# EAGLE design cp2102n-uart-usb (EAGLE 9.6.2)
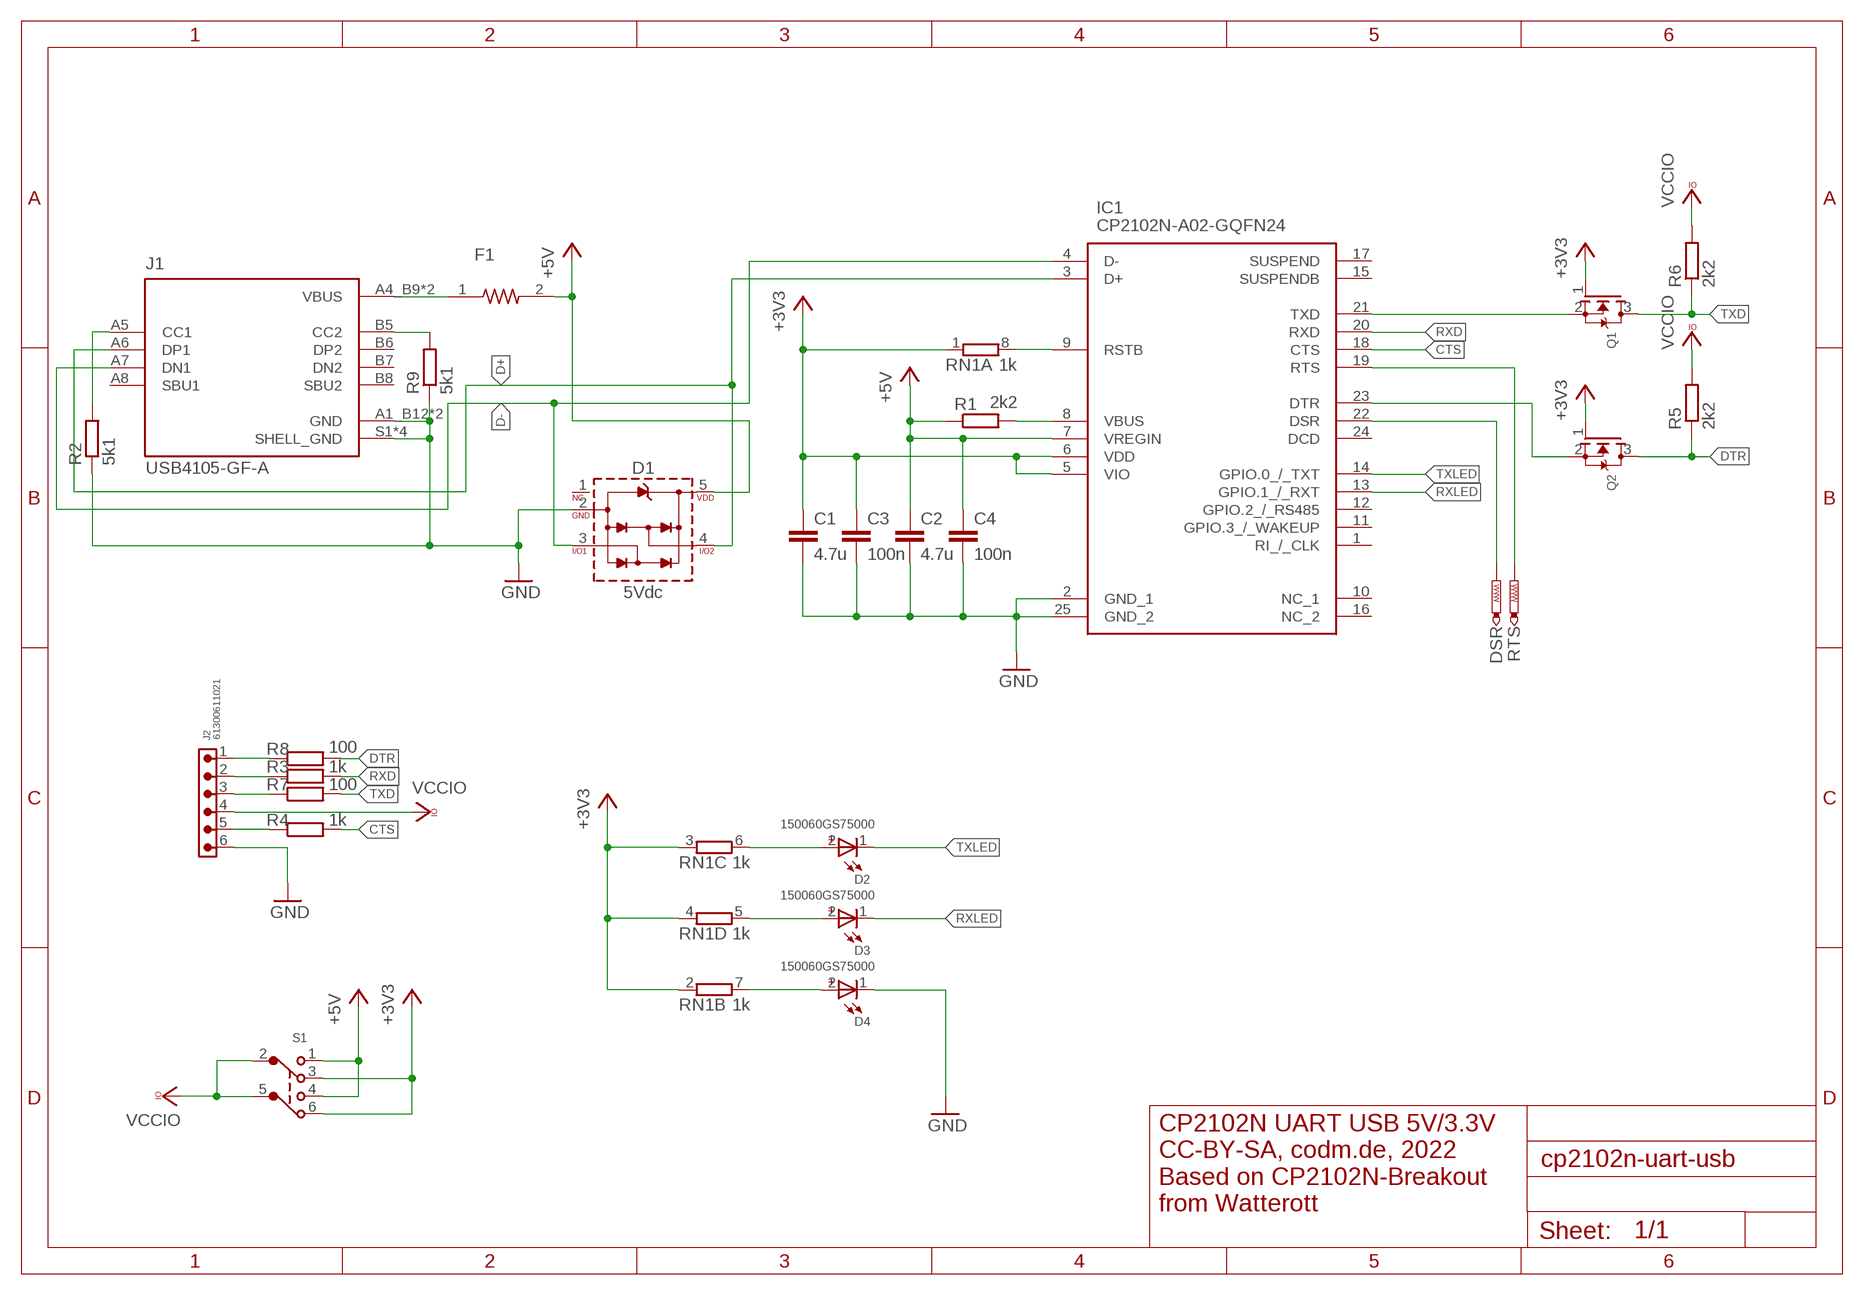
[diagram p0: schematic, sheet 1]

## Parts
C1  4.7u  C-EUC0603K  [C0603K]
C2  4.7u  C-EUC0603K  [C0603K]
C3  100n  C-EUC0603K  [C0603K]
C4  100n  C-EUC0603K  [C0603K]
D1  5Vdc  WE-TVS-HS_SOT23-5L_824011  [WE-TVS_SOT23-5L]
D2  150060GS75000  WL-SMCW_0603_150060GS75000  [WL-SMCW_0603]
D3  150060GS75000  WL-SMCW_0603_150060GS75000  [WL-SMCW_0603]
D4  150060GS75000  WL-SMCW_0603_150060GS75000  [WL-SMCW_0603]
DSR  PTR1B2,54  [B2,54]
F1  PICOSMDC050S-2  [RESC2012X65N]
IC1  CP2102N-A02-GQFN24  [QFN50P400X400X80-25N]
J1  USB4105-GF-A  [GCT_USB4105-GF-A]
J2  61300611021  6130XX11021_61300611021  [61300611021]
Q1  MOSFET-NREFLOW  [SOT23]
Q2  MOSFET-NREFLOW  [SOT23]
R1  2k2  R-EU_R0603RF  [R0603RF]
R2  5k1  R-EU_R0603RF  [R0603RF]
R3  1k  R-EU_R0603RF  [R0603RF]
R4  1k  R-EU_R0603RF  [R0603RF]
R5  2k2  R-EU_R0603RF  [R0603RF]
R6  2k2  R-EU_R0603RF  [R0603RF]
R7  100  R-EU_R0603RF  [R0603RF]
R8  100  R-EU_R0603RF  [R0603RF]
R9  5k1  R-EU_R0603RF  [R0603RF]
RN1  1k  4R-NEXB38V  [EXB38V]
RTS  PTR1B2,54  [B2,54]
S1  452403012014  [452403012014]

## Nets
+3V3: C1.1 C3.1 IC1.5(VIO) IC1.6(VDD) Q1.1(G) Q2.1(G) RN1.1 RN1.2 RN1.3 RN1.4 S1.3 S1.6
+5V: C2.1 C4.1 D1.5(VDD) F1.2 IC1.7(VREGIN) R1.1 S1.1 S1.4
CTS: IC1.18(CTS) R4.2
D+: D1.4(I/O2) IC1.3(D+) J1.A6(DP1)
D-: D1.3(I/O1) IC1.4(D-) J1.A7(DN1)
DTR: Q2.3(D) R5.1 R8.2
GND: C1.2 C2.2 C3.2 C4.2 D1.2(GND) D4.1(-) IC1.2(GND_1) IC1.25(GND_2) J1.A1_B12(GND) J1.B1_A12(GND) J1.S1(SHELL_GND) J1.S2(SHELL_GND) J1.S3(SHELL_GND) J1.S4(SHELL_GND) J2.6 R2.1 R9.1
N$1: J1.A5(CC1) R2.2
N$2: D3.2(+) RN1.5
N$3: IC1.19(RTS) RTS.TP
N$4: D2.2(+) RN1.6
N$5: J1.B5(CC2) R9.2
N$6: DSR.TP IC1.22(DSR)
N$7: F1.1 J1.A4_B9(VBUS) J1.B4_A9(VBUS)
N$8: IC1.21(TXD) Q1.2(S)
N$9: IC1.23(DTR) Q2.2(S)
N$10: J2.1 R8.1
N$11: J2.2 R3.1
N$12: J2.3 R7.1
N$13: J2.5 R4.1
N$15: D4.2(+) RN1.7
RSTB: IC1.9(RSTB) RN1.8
RXD: IC1.20(RXD) R3.2
RXLED: D3.1(-) IC1.13(GPIO.1_/_RXT)
TXD: Q1.3(D) R6.1 R7.2
TXLED: D2.1(-) IC1.14(GPIO.0_/_TXT)
VBUS: IC1.8(VBUS) R1.2
VCCIO: J2.4 R5.2 R6.2 S1.2 S1.5
Unconnected: D1.1(NC) IC1.1(RI_/_CLK) IC1.10(NC_1) IC1.11(GPIO.3_/_WAKEUP) IC1.12(GPIO.2_/_RS485) IC1.15(SUSPENDB) IC1.16(NC_2) IC1.17(SUSPEND) IC1.24(DCD) J1.A8(SBU1) J1.B6(DP2) J1.B7(DN2) J1.B8(SBU2)

## Notes on the sheet
- CP2102N UART USB 5V/3.3V
  CC-BY-SA, codm.de, 2022
  Based on CP2102N-Breakout
  from Watterott

## Library data of the parts
C1-C4 = rcl:C-EU: CAPACITOR, European symbol; SPICEPREFIX: C
D1 = Eagle_WE-TVS (rev22a):WE-TVS-HS_SOT23-5L_824011: WE-TVS TVS Diode – High Speed Series Characteristics Low clamping voltage Sturdy design Very low capacitance Flow Thru Design for a simple layout Rail to Rail protection Epoxy flame resistant UL94-V0 RoHS, REACH and free of halogens Applications Very fast data lines USB 2.0 Ethernet PoE VGA Sim Cards Keypads HS = High Speed <https://www.we-online.com/catalog/media/o14883v209%20Family_WE-TVS_HIGHSPEED.jpg> Details see: https://www.we-online.com/catalog/en/WE-TVS-HS Updated by Ella Wu 2021-12-16 2021(C) Wurth Elektronik; C-CH: 2pF; CHANNELS: 2+1; DATASHEET-URL: https://www.we-online.com/catalog/datasheet/824011.pdf; IPEAK: 13A; MOUNT: SMT; PART-NUMBER: 824011; VBR: 6.1V
D2-D4 = Eagle_WL-SMCW (rev22a):WL-SMCW_0603: WL-SMCW SMT Mono-color Chip LED Waterclea Characteristics Low energy consumption High reliability Low current requirement Fast switching No UV/IR radiation Smallest SMD LED package for exceptional brightness Top view LED Wide viewing angle Better solder ability Heat dissipation Applications Backlight for mobile and portable device keypads Indoor and outdoor message boards Flat backlight for LCDs, switches and symbols Display for industrial control systems and traffic Miniaturized color effects Pedestrian mark Optical indicators Tabular backlight: LCD, telephone key-press, power-switch, display board Indoor displays Signals Identifiers Backlight for automobile DVD LED General lighting Toys <https://www.we-online.com/catalog/media/o14904v209%20Family_WL-SMCW.jpg> Details see: https://www.we-online.com/catalog/en/WL-SMCW/ Updated BY Yingchun,Shan 2020-03-18 2020(C) Wurth Elektronik; CHIP-TECHNOLOGY: InGaN; DATASHEET-URL: https://www.we-online.com/catalog/datasheet/150060GS75000.pdf; DOMINANT-WAVELENGTH: 525nm; EMITTING-COLOR: Green; FORWARD-VOLTAGE: 140°; LUMINOUS-INTENSITY: 430mcd; PART-NUMBER: 150060GS75000; PEAK-WAVELENGTH: 515nm
DSR RTS = testpad:PTR1: TEST PIN
F1 = PICOSMDC050S-2:PICOSMDC050S-2: FUSE, RESETTABLE PTC, 6VDC, 0.5A, SMD Check availability <https://pricing.snapeda.com/parts/PICOSMDC050S-2/Littelfuse%20Inc./view-part?ref=eda>; AVAILABILITY: In Stock; DESCRIPTION: Polymeric PTC Resettable Fuse 6V 500 mA Ih Surface Mount 0805 (2012 Metric), Concave; MF: Littelfuse Inc.; MP: PICOSMDC050S-2; PACKAGE: 0805 TE Connectivity; PRICE: None; PURCHASE-URL: https://pricing.snapeda.com/search/part/PICOSMDC050S-2/?ref=eda
IC1 = CP2102N-A02-GQFN24:CP2102N-A02-GQFN24: USB Interface IC USB to UART bridge - QFN24 Source: Datasheet <https://componentsearchengine.com/Datasheets/1/CP2102N-A02-GQFN24.pdf> Check availability <https://pricing.snapeda.com/parts/CP2102N-A02-GQFN24/Silicon%20Labs/view-part?ref=eda>; AVAILABILITY: In Stock; DESCRIPTION: USB Bridge, USB to UART USB 2.0 UART Interface 24-QFN (4x4); MF: Silicon Labs; MP: CP2102N-A02-GQFN24; PACKAGE: WFQFN-24 Silicon Labs; PRICE: None; PURCHASE-URL: https://pricing.snapeda.com/search/part/CP2102N-A02-GQFN24/?ref=eda
J1 = USB4105-GF-A:USB4105-GF-A: USB-C (USB TYPE-C) USB 2.0 Receptacle Connector 24 (16+8 Dummy) Position Surface Mount, Right Angle; Through Hole Check availability <https://pricing.snapeda.com/parts/USB4105-GF-A/GCT/view-part?ref=eda>; AVAILABILITY: In Stock; DESCRIPTION: USB-C (USB TYPE-C) USB 2.0 Receptacle Connector 24 (16+8 Dummy) Position Surface Mount, Right Angle; Through Hole; MF: GCT; MP: USB4105-GF-A; PACKAGE: None; PRICE: None; PURCHASE-URL: https://pricing.snapeda.com/search/part/USB4105-GF-A/?ref=eda
J2 = Eagle_WR-PHD (rev21a):6130XX11021_61300611021: WR-PHD 2.54 mm THT Angled Pin Header ARTICLE PROPERTIES: Pins:2;​ 3;​ 4;​ 5;​ 6;​ 7;​ 8;​ 9;​ 10;​ 12;​ 14;​ 16;​ 18;​ 22;​ 32;​ 34;​ 36;​ 40 KIND PROPERTIES: Pitch：2.54 mm Quality Class:3 as per CECC 75 301-802 Rows：Single Gender：Pin Header Type：Angled MATERIAL PROPERTIES: Insulator Material :PA6T Insulator Flammability Rating:UL94 V-0 Contact Material:Copper Alloy Contact Plating:Gold Contact Type:Stamped GENERAL INFORMATION Operating Temperature:-40 up to +105 °C Compliance:Lead free / RoHS ELECTRICAL PROPERTIES: Rated Current:3 A IR 1:3 A Withstanding Voltage:500 V (AC) Contact Resistance:20 mΩ RISO:1000 MΩ CERTIFICATION UL Approval:E323964 PACKAGING PROPERTIES Packaging:Bag <https://katalog.we-online.com/media/images/v2/o33210v209%20Family_WR-PHD_6130xx11021.jpg> Details see: https://katalog.we-online.com/en/em/PHD_2_54_THT_ANGLED_PIN_HEADER_6130XX11021 Updated by Yingchun,Shan 2019-10-16 2019 (C) Würth Elektronik; DATASHEET-URL: https://www.we-online.com/catalog/datasheet/61300611021.pdf; GENDER: Pin Header; IR: 3A; MOUNT: THT; PACKAGING: Bag; PART-NUMBER: 61300611021; PINS: 6; PITCH: 2.54mm; ROWS: Single; TYPE: Angled
Q1 Q2 = adafruit:MOSFET-N: N-Channel Mosfet 2N7002E - 60V 260mA SOT23 [Digikey: 2N7002ET1GOSTR-ND] - REEL BSH103 - 30V 850mA SOT23 [Digikey: 568-5013-1-ND]
R1-R9 = codm:R-EU_
RN1 = resistor-dil:4R-N: Array Chip Resistor Source: RS Component / Phycomp; OC_FARNELL: unknown; OC_NEWARK: unknown
S1 = Eagle_WS-SLSV (rev20a):452403012014: WS-SLSV SMD Mini Slide Switch, Same Side Connection 7.65 x 5.5 mm Properties Actuator Material:LCP Actuator Flammability Rating:UL94 V-0 Actuator Color:Black Frame Material:PA6T Frame Flammability Rating:UL94 V-0 Frame Color:Black Contact Material:Copper Alloy Contact Plating:Silver Terminal Material:Copper Alloy Terminal Plating:Silver VR:6 V (DC) VR:6 V (DC) Contact Resistance Initial:50 mΩ Contact Resistance After Life Test:200 mΩ RISO:100 MΩ Withstanding Voltage:500 V (AC) Qty.:1500 Electrical Properties IR:300 mA Mechanical Properties Operation Force:350g Packaging Properties Packaging :Tape and Reel <https://www.we-online.com/catalog/media/o64640v209%20Family_WS-SLSV_452403012014.jpg> Details see: https://www.we-online.com/catalog/en/SLSV_7_65X_5_5_SMD_VERTICAL/ Updated by yingchun,Shan;2020-02-25 2020(C) Würth Elektronik; DATASHEET-URL: https://www.we-online.com/catalog/datasheet/452403012014.pdf; PACKAGING: Tape and Reel; PART-NUMBER: 452403012014; QTY: 350

## Board
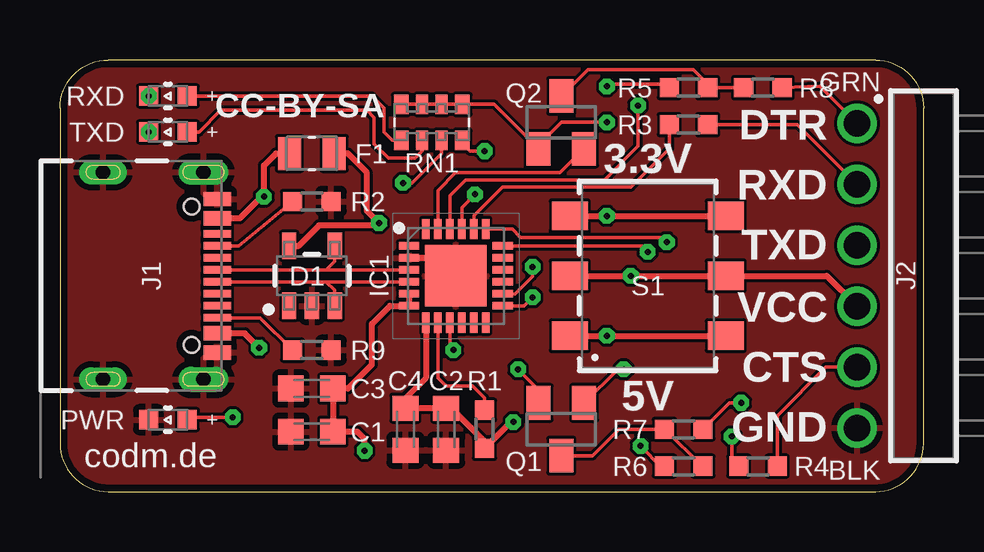
[diagram p1: board, top side]
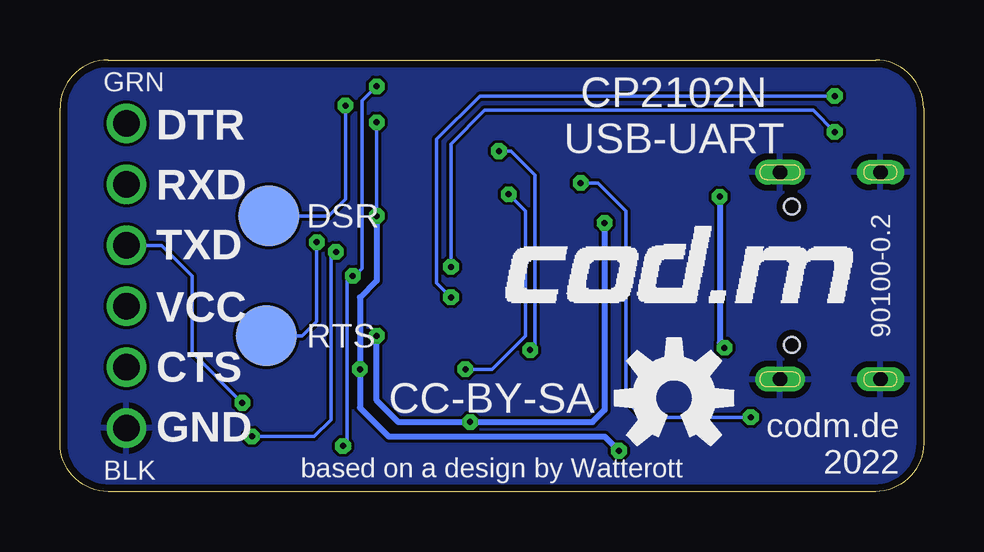
[diagram p2: board, bottom side, seen from below]

Size 36 x 18 mm. Coordinates in mm from the lower left corner, seen from the top.
Outline: 2,0 34,0 arc90 36,2 36,16 arc90 34,18 2,18 arc90 0,16 0,2 arc90 2,0
Copper layers (1*16): Top 0.035mm / dielectric 1.5mm / Bottom 0.035mm
Design rules "aisler_2_layer_complex": minimum track width 0.125mm, minimum drill 0.2mm, track to track 0.125mm, track to pad 0.125mm, pad to pad 0.125mm, via to via 0.125mm, smd to smd 0.125mm, copper to edge 0.3mm, drill to drill 0.25mm, minimum pad ring 0.2mm, minimum via ring 0.2mm, stop-mask expansion 0mil, vias tented up to drill 0mil, thermal gap 10mil

### Footprints (pad centres in the part's own frame; a part is rotated, then mirrored left to right if it is on the bottom)
C0603K = smd 1.05 x 1.08: 1 -0.875,0; 2 0.875,0
WE-TVS_SOT23-5L = smd 0.6 x 1.1: 1 -0.95,-1.25; 2 0,-1.25; 3 0.95,-1.25; 4 0.95,1.25; 5 -0.95,1.25
WL-SMCW_0603 = smd 0.8 x 0.8: 1 -0.8,0; 2 0.8,0
B2,54 = smd 2.54 x 2.54: TP 0,0
RESC2012X65N = smd 0.97 x 1.38: 1 -0.93,0; 2 0.93,0
QFN50P400X400X80-25N = smd 0.85 x 0.3: 1 -1.95,1.25; 2 -1.95,0.75; 3 -1.95,0.25; 4 -1.95,-0.25; 5 -1.95,-0.75; 6 -1.95,-1.25; 13 1.95,-1.25; 14 1.95,-0.75; 15 1.95,-0.25; 16 1.95,0.25; 17 1.95,0.75; 18 1.95,1.25 | smd 0.3 x 0.85: 7 -1.25,-1.95; 8 -0.75,-1.95; 9 -0.25,-1.95; 10 0.25,-1.95; 11 0.75,-1.95; 12 1.25,-1.95; 19 1.25,1.95; 20 0.75,1.95; 21 0.25,1.95; 22 -0.25,1.95; 23 -0.75,1.95; 24 -1.25,1.95 | smd 2.55 x 2.55: 25 0,0
GCT_USB4105-GF-A = smd 0.6 x 1.15: A1_B12 -3.2,4.755; A4_B9 -2.4,4.755; B1_A12 3.2,4.755; B4_A9 2.4,4.755 | smd 0.3 x 1.15: A5 -1.25,4.755; A6 -0.25,4.755; A7 0.25,4.755; A8 1.25,4.755; B5 1.75,4.755; B6 0.75,4.755; B7 -0.75,4.755; B8 -1.75,4.755 | drill 0.6 pad 1.05 long: S1 -4.32,4.18; S4 4.32,4.18 | drill 0.6 pad 1 long: S2 -4.32,0; S3 4.32,0 | hole 0.65: 2.89,3.68; -2.89,3.68
61300611021 = drill 1.1: 1 6.35,2.77; 2 3.81,2.77; 3 1.27,2.77; 4 -1.27,2.77; 5 -3.81,2.77; 6 -6.35,2.77
SOT23 = smd 1 x 1.4: 1 -0.95,-1.1; 2 0.95,-1.1; 3 0,1.1
R0603RF = smd 0.8 x 0.8: 1 -0.8,0; 2 0.8,0
EXB38V = smd 0.6 x 0.8: 1 -1.275,-0.75; 4 1.275,-0.75; 5 1.275,0.75; 8 -1.275,0.75 | smd 0.5 x 0.8: 2 -0.4,-0.75; 3 0.4,-0.75; 6 0.4,0.75; 7 -0.4,0.75
452403012014 = smd 1.2 x 1.5: 1 -2.5,3.25; 2 0,3.25; 3 2.5,3.25; 4 -2.5,-3.25; 5 0,-3.25; 6 2.5,-3.25

### Placement (x,y rotation side)
C1  10.5,2.5 180 top
C2  16.1,2.6 270 top
C3  10.5,4.3 180 top
C4  14.4,2.6 270 top
D1  10.5,9 0 top
D2  4.5,15 0 top
D3  4.5,16.5 0 top
D4  4.5,3 0 top
DSR  27.3,11.5 0 bottom
F1  10.5,14.1 0 top
IC1  16.5,9 0 top
J1  1.8,9 270 top
J2  36,9 90 top
Q1  20.9,2.6 180 top
Q2  20.9,15.4 0 top
R1  17.7,2.6 90 top
R2  10.5,12.1 180 top
R3  26.2,15.3 180 top
R4  29.1,1.06 180 top
R5  26.2,16.84 180 top
R6  26,1.06 180 top
R7  26,2.6 180 top
R8  29.3,16.84 180 top
R9  10.5,5.9 180 top
RN1  15.5,15.4 180 top
RTS  27.4,6.5 0 bottom
S1  24.5,9 90 top
U$1  [CODM-LOGO]  17.4,7.9 0 bottom
U$2  [OSHW-LOGO-M]  10.4,3.9 0 bottom

### Tracks (layer width: path | path; a pad name or v marks a point on that pad's centre or on a via)
+3V3  (via drill 0.25)
  Top 0.152: Q1.1 23.25,5.1 v23.5,5.1 | RN1.4 RN1.3 RN1.2 RN1.1 18.1,16.15 19.88,14.38 | Q2.1 19.88,14.38 | 19.88,14.38 20.9,15.4 v22.8,15.4
  Top 0.254: IC1.5 IC1.6 13.75,7.75 13,7 13,5.3 12,4.3 C3.1 C1.1 12.4,2.5 12.7,2.2 v12.7,1.7 | S1.3 v22.8,11.5 S1.6
  Bottom 0.152: v22.8,11.5 v22.8,15.4
  Bottom 0.254: v22.8,11.5 22.8,8.8 23.5,8.1 v23.5,5.1 23.5,3.5 22.3,2.3 13.3,2.3 v12.7,1.7
+5V  (via drill 0.25)
  Top 0.254: S1.1 v22.8,6.5 S1.4 | D1.5 9.95,10.25 10.8,11.1 13.2,11.1 v13.3,11.2 12.8,11.7 12.8,13.3 12,14.1 F1.2 | v18.9,2.9 18.8,2.9 R1.1 17.7,2.1 16.32,3.48 C2.1 C4.1 14.4,3.9 15.25,4.75 IC1.7
  Bottom 0.254: v22.8,6.5 22.8,3.8 21.9,2.9 v18.9,2.9 13.8,2.9 13.3,3.4 v13.3,11.2
CTS  (via drill 0.25)
  Top 0.152: IC1.18 24.25,10.25 v24.5,10 | v28,2.3 28,1.3 R4.2
  Bottom 0.152: v24.5,10 24.7,9.8 24.7,3 25.4,2.3 v28,2.3
D+
  Top 0.152: 11.1,9.25 IC1.3 | 11.1,9.25 J1.A6 | D1.4 11.45,9.6 11.1,9.25
D-
  Top 0.152: IC1.4 11.1,8.75 | 11.1,8.75 J1.A7 | D1.3 11.45,8.4 11.1,8.75
DTR
  Top 0.152: R8.2 R5.1 27,17 26.4,17.6 22,17.6 Q2.3
GND
  Top 0.254: IC1.25 15.75,9.75 IC1.2
  pour Top (rank 2): 0,0 0,18 36,18 36,0
  pour Bottom: 0,0 36,0 36,18 0,18
N$1
  Top 0.152: J1.A5 7.44,10.25 R2.2
N$2
  Top 0.152: D3.2 13,16.5 13.5,16 13.5,15 13.85,14.65 RN1.5
N$3  (via drill 0.25)
  Top 0.152: IC1.19 18.86,10.94 19.2,10.6 25.1,10.6 v25.3,10.4
  Bottom 0.152: v25.3,10.4 25.3,7.1 25.9,6.5 RTS.TP
N$4
  Top 0.152: RN1.6 15.1,14.2 14.8,13.9 13.7,13.9 13.1,14.5 13.1,15.6 12.8,15.9 6.7,15.9 5.8,15 D2.2
N$5
  Top 0.152: J1.B5 8.35,7.25 R9.2
N$6  (via drill 0.25)
  Top 0.152: IC1.22 16.25,12.35 16.9,13 22.7,13 24.1,14.4 v24.1,16.1
  Bottom 0.152: v24.1,16.1 24.1,12.2 24.8,11.5 DSR.TP
N$7  (via drill 0.25)
  Top 0.254: J1.A4_B9 7.5,11.4 8.4,12.3 v8.5,12.3 8.5,13.6 9,14.1 F1.1 | v8.3,6 7.7,6.6 J1.B4_A9
  Bottom 0.254: v8.5,12.3 8.5,6.2 v8.3,6
N$8  (via drill 0.25)
  Top 0.152: IC1.21 16.75,11.85 v17.3,12.4 | Q1.2 19.95,4.25 v19.1,5.1
  Bottom 0.152: v17.3,12.4 16.6,11.7 16.6,6.5 18,5.1 v19.1,5.1
N$9
  Top 0.152: IC1.23 15.75,12.55 16.5,13.3 20,13.3 20.25,13.3 20.85,13.3 Q2.2
N$10
  Top 0.152: R8.1 31.68,16.9 J2.1
N$11
  Top 0.152: R3.1 30.74,15.3 J2.2
N$12  (via drill 0.25)
  Top 0.152: R7.1 27.9,3.7 v28.4,3.7
  Bottom 0.152: v28.4,3.7 30.5,5.8 30.5,9 31.77,10.27 J2.3
N$13
  Top 0.152: R4.1 29.9,3.16 31.93,5.19 J2.5
N$15  (via drill 0.25)
  Top 0.152: v7.2,3.1 5.5,3.1 5.43,3.03 5.38,3 D4.2 | v14.3,12.87 14.67,12.87 15.9,14.1 RN1.7
  Bottom 0.152: v7.2,3.1 11.7,3.1 12.4,3.8 12.4,11.7 13.57,12.87 v14.3,12.87
RSTB  (via drill 0.25)
  Top 0.152: IC1.9 16.25,6.05 v16.4,5.9 | RN1.8 16.77,14.53 17.1,14.2 v17.7,14.2
  Bottom 0.152: v17.7,14.2 17.2,14.2 16.2,13.2 16.2,6.1 v16.4,5.9
RXD
  Top 0.152: IC1.20 17.25,11.51 18.44,12.7 23.8,12.7 25.4,14.3 R3.2
RXLED  (via drill 0.25)
  Top 0.152: IC1.13 19.35,7.75 v19.7,8.1
  Bottom 0.152: v19.7,8.1 20.3,8.7 20.3,14.7 18.5,16.5 D3.1
  other vias: 3.7,16.5
TXD
  Top 0.152: Q1.3 22.2,1.5 23.3,2.6 R7.2 R6.1
TXLED  (via drill 0.25)
  Top 0.152: IC1.14 18.98,8.25 19.7,8.97 v19.7,9.38
  Bottom 0.152: v19.7,9.38 19.7,14.5 18.3,15.9 4.6,15.9 D2.1
  other vias: 3.7,15
VBUS
  Top 0.152: R1.2 17.7,3.9 17.2,4.4 16.1,4.4 15.75,4.75 IC1.8
VCCIO  (via drill 0.25)
  Top 0.152: R5.2 25.3,17 22.9,17 v22.8,16.9 | v24.2,1.9 25.1,1 R6.2
  Top 0.254: S1.2 v23.8,9 S1.5 31.96,9 J2.4
  Bottom 0.152: v22.8,16.9 23.4,16.3 23.4,9.3 23.7,9 v23.8,9 24.03,8.77 24.03,2.07 v24.2,1.9

### Text on the board
tNames: GRN | RXD | CC-BY-SA | TXD | DTR | 3.3V | RXD | TXD | VCC | CTS | 5V | PWR | GND | codm.de | BLK
bNames: GRN | CP2102N / USB-UART | DTR | RXD | TXD | 90100-0.2 | VCC | CTS | CC-BY-SA | GND | codm.de / 2022 | based on a design by Watterott | BLK